# EAGLE schematic Tachomoter (EAGLE 9.6.2)
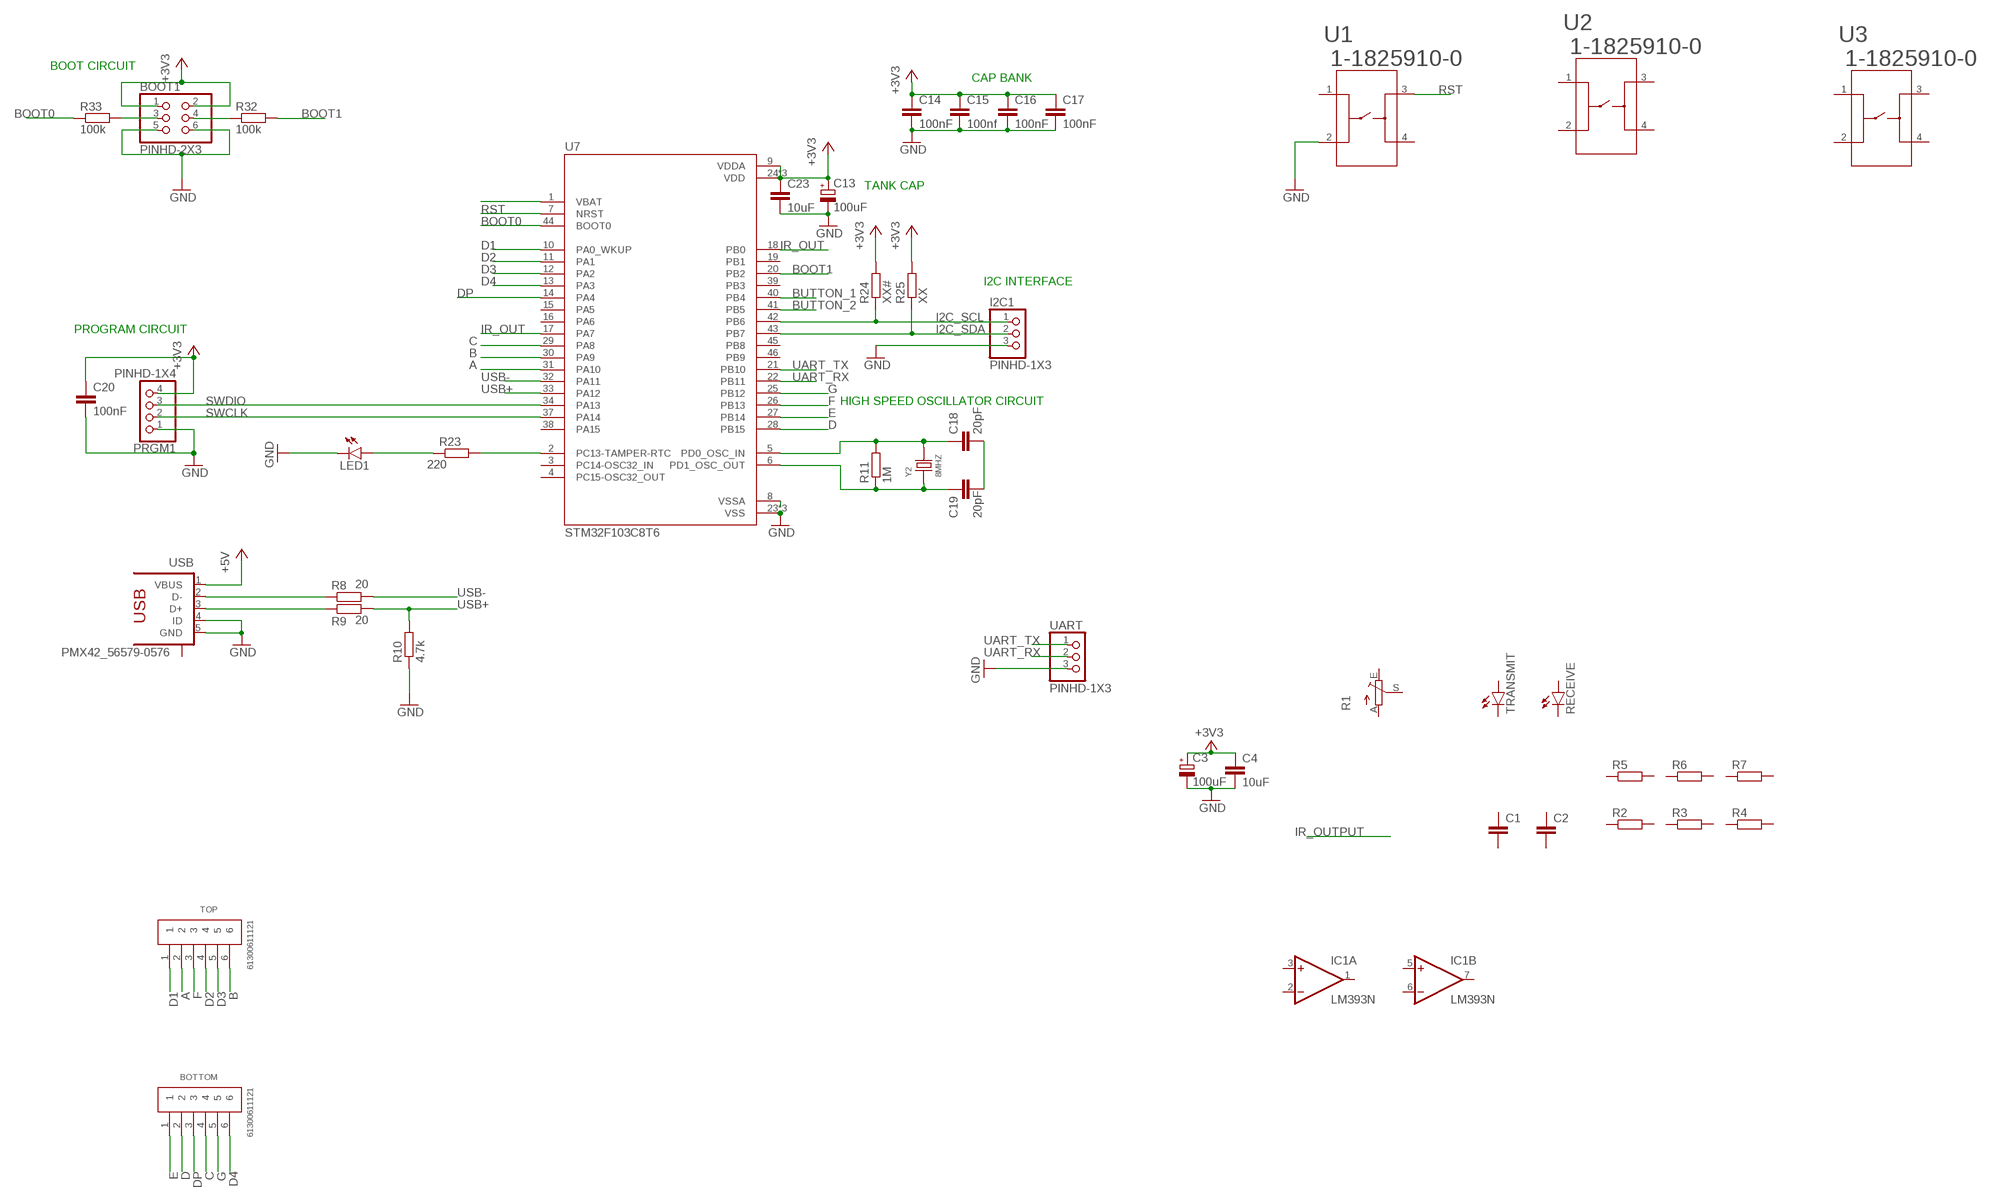
[diagram p0: schematic, sheet 1]

## Parts
BOOT1  PINHD-2X3  [2X03]
BOTTOM  61300611121  [61300611121]
C1  C-EUC1206  [C1206]
C2  C-EUC1206  [C1206]
C3  100uF  CPOL-EUE5-5  [E5-5]
C4  10uF  C-EUC1206  [C1206]
C13  100uF  CPOL-EUE5-5  [E5-5]
C14  100nF  C-EUC1206  [C1206]
C15  100nf  C-EUC1206  [C1206]
C16  100nF  C-EUC1206  [C1206]
C17  100nF  C-EUC1206  [C1206]
C18  20pF  C-EUC1206  [C1206]
C19  20pF  C-EUC1206  [C1206]
C20  100nF  C-EUC1206  [C1206]
C23  10uF  C-EUC1206  [C1206]
I2C1  PINHD-1X3  [1X03]
IC1  LM393N  [DIL08]
LED1  LED5MM  [LED5MM]
PRGM1  PINHD-1X4  [1X04]
R1  TRIM_EU-RJ9W  [RJ9W]
R2  R-EU_R1206  [R1206]
R3  R-EU_R1206  [R1206]
R4  R-EU_R1206  [R1206]
R5  R-EU_R1206  [R1206]
R6  R-EU_R1206  [R1206]
R7  R-EU_R1206  [R1206]
R8  20  R-EU_R1206  [R1206]
R9  20  R-EU_R1206  [R1206]
R10  4.7k  R-EU_R1206  [R1206]
R11  1M  R-EU_R1206  [R1206]
R23  220  R-EU_R1206  [R1206]
R24  XX#  R-EU_R1206  [R1206]
R25  XX  R-EU_R1206  [R1206]
R32  100k  R-EU_R1206  [R1206]
R33  100k  R-EU_R1206  [R1206]
RECEIVE  LED5MM  [LED5MM]
TOP  61300611121  [61300611121]
TRANSMIT  LED5MM  [LED5MM]
U1  1-1825910-0  [SWITCH_1-1825910-0]
U2  1-1825910-0  [SWITCH_1-1825910-0]
U3  1-1825910-0  [SWITCH_1-1825910-0]
U7  STM32F103C8T6  [QFP50P900X900X160-48N]
UART  PINHD-1X3  [1X03]
USB  PMX42_56579-0576  [PMX42_56579-0576]
Y2  8MHZ  DIP-CRYSTAL-16MHZ-18PF-30PPM-40R(HC49US)  [HC49US]

## Nets
+3V3: BOOT1.1 BOOT1.2 C3.+ C4.1 C13.+ C14.1 C15.1 C16.1 C17.1 C20.1 C23.1 PRGM1.4 R24.2 R25.2 U7.9(VDDA) U7.24(VDD) U7.36(VDD) U7.48(VDD)
+5V: USB.1(VBUS)
A: TOP.2 U7.31(PA10)
B: TOP.6 U7.30(PA9)
BOOT0: R33.1 U7.44(BOOT0)
BOOT1: R32.2 U7.20(PB2)
BUTTON_1: U7.40(PB4)
BUTTON_2: U7.41(PB5)
C: BOTTOM.4 U7.29(PA8)
D: BOTTOM.2 U7.28(PB15)
D1: TOP.1 U7.10(PA0_WKUP)
D2: TOP.4 U7.11(PA1)
D3: TOP.5 U7.12(PA2)
D4: BOTTOM.6 U7.13(PA3)
DP: BOTTOM.3 U7.14(PA4)
E: BOTTOM.1 U7.27(PB14)
F: TOP.3 U7.26(PB13)
G: BOTTOM.5 U7.25(PB12)
GND: BOOT1.5 BOOT1.6 C3.- C4.2 C13.- C14.2 C15.2 C16.2 C17.2 C20.2 C23.2 I2C1.3 LED1.K(C) PRGM1.1 R10.1 U1.2 U7.8(VSSA) U7.23(VSS) U7.35(VSS) U7.47(VSS) UART.3 USB.4(ID) USB.5(GND)
I2C_SCL: I2C1.1 R24.1 U7.42(PB6)
I2C_SDA: I2C1.2 R25.1 U7.43(PB7)
IR_OUT: U7.17(PA7) U7.18(PB0)
N$1: C18.2 C19.2
N$3: C18.1 R11.2 U7.5(PD0_OSC_IN) Y2.2
N$4: R8.1 USB.2(D-)
N$5: C19.1 R11.1 U7.6(PD1_OSC_OUT) Y2.1
N$6: R9.1 USB.3(D+)
N$16: BOOT1.4 R32.1
N$22: U7.1(VBAT)
N$27: R23.2 U7.2(PC13-TAMPER-RTC)
N$28: LED1.A R23.1
N$29: BOOT1.3 R33.2
RST: U1.3 U7.7(NRST)
SWCLK: PRGM1.2 U7.37(PA14)
SWDIO: PRGM1.3 U7.34(PA13)
UART_RX: U7.22(PB11) UART.2
UART_TX: U7.21(PB10) UART.1
USB+: R9.2 R10.2 U7.33(PA12)
USB-: R8.2 U7.32(PA11)
Unconnected: C1.1 C1.2 C2.1 C2.2 IC1.1(A:OUT) IC1.2(A:-IN) IC1.3(A:+IN) IC1.5(B:+IN) IC1.6(B:-IN) IC1.7(B:OUT) R1.A R1.E R1.S R2.1 R2.2 R3.1 R3.2 R4.1 R4.2 R5.1 R5.2 R6.1 R6.2 R7.1 R7.2 RECEIVE.A RECEIVE.K(C) TRANSMIT.A TRANSMIT.K(C) U1.1 U1.4 U2.1 U2.2 U2.3 U2.4 U3.1 U3.2 U3.3 U3.4 U7.3(PC14-OSC32_IN) U7.4(PC15-OSC32_OUT) U7.15(PA5) U7.16(PA6) U7.19(PB1) U7.38(PA15) U7.39(PB3) U7.45(PB8) U7.46(PB9) USB.S1(S) USB.S2(S) USB.S3(S) USB.S4(S)

## Notes on the sheet
- BOOT CIRCUIT
- CAP BANK
- TANK CAP
- I2C INTERFACE
- PROGRAM CIRCUIT
- HIGH SPEED OSCILLATOR CIRCUIT

## Power pins joined to a net without a drawn wire
V+: IC1.8(P:V+)
V-: IC1.4(P:V-)

## Library data of the parts
BOOT1 = Connector:PINHD-2X3: PIN HEADER; CATEGORY: CONNECTOR; SUB-CATEGORY: PIN-HEADER
BOTTOM TOP = Headers:61300611121: CONN HEADER VERT 6POS 2.54MM Manufacturer's datasheet <https://katalog.we-online.de/em/datasheet/6130xx11121.pdf>; CREATED_BY: PCBLayout.com; DIGI_KEY_PART_NUMBER: 732-5319-ND; MANUFACTURER: Wurth Electronics Inc.; MPN: 61300611121
C1 C2 C4 C14-C20 C23 = rcl:C-EU: CAPACITOR, European symbol; SPICEPREFIX: C
C3 C13 = rcl:CPOL-EU: POLARIZED CAPACITOR, European symbol; SPICEPREFIX: C
I2C1 UART = Connector:PINHD-1X3: PIN HEADER; CATEGORY: CONNECTOR; SUB-CATEGORY: PIN-HEADER
IC1 = linear:LM393: COMPARATOR
LED1 RECEIVE TRANSMIT = led:LED: LED OSRAM: - CHIPLED LG R971, LG N971, LY N971, LG Q971, LY Q971, LO R971, LY R971 LH N974, LH R974 LS Q976, LO Q976, LY Q976 LO Q996 - Hyper CHIPLED LW Q18S LB Q993, LB Q99A, LB R99A - SideLED LS A670, LO A670, LY A670, LG A670, LP A670 LB A673, LV A673, LT A673, LW A673 LH A674 LY A675 LS A676, LA A676, LO A676, LY A676, LW A676 LS A679, LY A679, LG A679 - Hyper Micro SIDELED® LS Y876, LA Y876, LO Y876, LY Y876 LT Y87S - SmartLED LW L88C, LW L88S LB L89C, LB L89S, LG L890 LS L89K, LO L89K, LY L89K LS L896, LA L896, LO L896, LY L896 - TOPLED LS T670, LO T670, LY T670, LG T670, LP T670 LSG T670, LSP T670, LSY T670, LOP T670, LYG T670 LG T671, LOG T671, LSG T671 LB T673, LV T673, LT T673, LW T673 LH T674 LS T676, LA T676, LO T676, LY T676, LB T676, LH T676, LSB T676, LW T676 LB T67C, LV T67C, LT T67C, LS T67K, LO T67K, LY T67K, LW E67C LS E67B, LA E67B, LO E67B, LY E67B, LB E67C, LV E67C, LT E67C LW T67C LS T679, LY T679, LG T679 LS T770, LO T770, LY T770, LG T770, LP T770 LB T773, LV T773, LT T773, LW T773 LH T774 LS E675, LA E675, LY E675, LS T675 LS T776, LA T776, LO T776, LY T776, LB T776 LHGB T686 LT T68C, LB T68C - Hyper Mini TOPLED® LB M676 - Mini TOPLED Santana® LG M470 LS M47K, LO M47K, LY M47K Source: http://www.osram.convergy.de LUXEON: - LUMILED® LXK2-PW12-R00, LXK2-PW12-S00, LXK2-PW14-U00, LXK2-PW14-V00 LXK2-PM12-R00, LXK2-PM12-S00, LXK2-PM14-U00 LXK2-PE12-Q00, LXK2-PE12-R00, LXK2-PE12-S00, LXK2-PE14-T00, LXK2-PE14-U00 LXK2-PB12-K00, LXK2-PB12-L00, LXK2-PB12-M00, LXK2-PB14-N00, LXK2-PB14-P00, LXK2-PB14-Q00 LXK2-PR12-L00, LXK2-PR12-M00, LXK2-PR14-Q00, LXK2-PR14-R00 LXK2-PD12-Q00, LXK2-PD12-R00, LXK2-PD12-S00 LXK2-PH12-R00, LXK2-PH12-S00 LXK2-PL12-P00, LXK2-PL12-Q00, LXK2-PL12-R00 Source: www.luxeon.com KINGBRIGHT: KA-3528ASYC Source: www.kingbright.com
PRGM1 = Connector:PINHD-1X4: PIN HEADER; CATEGORY: CONNECTOR; SUB-CATEGORY: PIN-HEADER
R1 = pot:TRIM_EU-: POTENTIOMETER
R2-R11 R23-R25 R32 R33 = rcl:R-EU_: RESISTOR, European symbol; SPICEPREFIX: R
U1-U3 = Switches:1-1825910-0; BUILT_BY: EMA_UL_Team; CATEGORY: Tactile Switches; COPYRIGHT: Copyright (C) 2016 Accelerated Designs. All rights reserved; DESCRIPTION: FSM6JH=6MM TACT SWITCH, HIGH TEMP; MANUFACTURER_PART_NUMBER: 1-1825910-0; PART_STATUS: active; SERIES: Unknown; VENDOR: TE Connectivity
U7 = STM32F103C8T6:STM32F103C8T6: Mainstream Performance line, ARM Cortex-M3 MCU with 64 Kbytes Flash, 72 MHz CPU, motor control, USB and CAN Check prices <https://pricing.snapeda.com/search/part/STM32F103C8T6/?ref=eda>; AVAILABILITY: Good; DESCRIPTION: ARM® Cortex®-M3 STM32F1 Microcontroller IC 32-Bit 72MHz 64KB (64K x 8) FLASH 48-LQFP (7x7); MF: STMicroelectronics; MP: STM32F103C8T6; PACKAGE: LQFP-48 STMicroelectronics; PRICE: None; PURCHASE-URL: https://pricing.snapeda.com/search/part/STM32F103C8T6/?ref=eda
USB = 52101-101-REV-A_v16:PMX42_56579-0576: USB - OTG, miniUSB Type AB, Molex
Y2 = OPL_Crystal Oscillator:DIP-CRYSTAL-16MHZ-18PF-30PPM-40R(HC49US): 306010014; MPN: HC-49US 16.000MHz; VALUE: 16MHZ